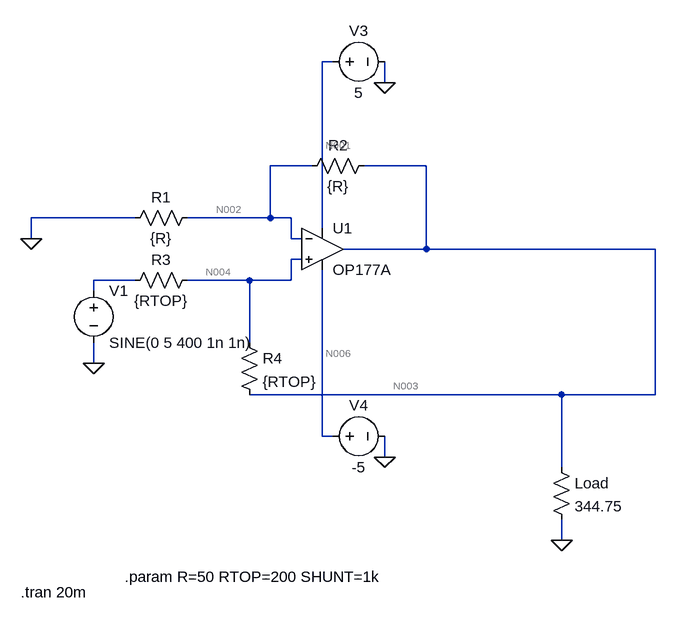
[diagram p0: schematic MHCP.asc]
MHCP.asc, the LTspice schematic file:
Version 4.1
SHEET 1 932 816
WIRE 432 -16 416 -16
WIRE 512 16 512 -16
WIRE 400 144 336 144
WIRE 576 144 480 144
WIRE 128 224 -32 224
WIRE 336 224 336 144
WIRE 336 224 208 224
WIRE 368 224 336 224
WIRE 416 240 416 -16
WIRE -32 256 -32 224
WIRE 368 256 368 224
WIRE 384 256 368 256
WIRE 576 272 576 144
WIRE 576 272 448 272
WIRE 928 272 576 272
WIRE 384 288 368 288
WIRE 128 320 64 320
WIRE 304 320 208 320
WIRE 368 320 368 288
WIRE 368 320 304 320
WIRE 64 336 64 320
WIRE 304 416 304 320
WIRE 64 448 64 416
WIRE 784 496 304 496
WIRE 928 496 928 272
WIRE 928 496 784 496
WIRE 416 560 416 304
WIRE 432 560 416 560
WIRE 512 592 512 560
WIRE 784 608 784 496
WIRE 784 720 784 688
FLAG 784 720 0
FLAG -32 256 0
FLAG 64 448 0
FLAG 512 16 0
FLAG 512 592 0
SYMBOL OpAmps\\OP177A 416 208 R0
SYMATTR InstName U1
SYMBOL res 224 208 R90
WINDOW 0 0 56 VBottom 2
WINDOW 3 32 56 VTop 2
SYMATTR InstName R1
SYMATTR Value {R}
SYMBOL res 496 128 R90
WINDOW 0 0 56 VBottom 2
WINDOW 3 32 56 VTop 2
SYMATTR InstName R2
SYMATTR Value {R}
SYMBOL res 224 304 R90
WINDOW 0 0 56 VBottom 2
WINDOW 3 32 56 VTop 2
SYMATTR InstName R3
SYMATTR Value {RTOP}
SYMBOL res 288 400 R0
SYMATTR InstName R4
SYMATTR Value {RTOP}
SYMBOL res 768 592 R0
SYMATTR InstName Load
SYMATTR Value 344.75
SYMBOL voltage 64 320 R0
WINDOW 123 0 0 Left 0
WINDOW 39 0 0 Left 0
SYMATTR InstName V1
SYMATTR Value SINE(0 5 400 1n 1n)
SYMBOL voltage 416 -16 R270
WINDOW 0 32 56 VTop 2
WINDOW 3 -32 56 VBottom 2
WINDOW 123 0 0 Left 0
WINDOW 39 0 0 Left 0
SYMATTR InstName V3
SYMATTR Value 5
SYMBOL voltage 416 560 R270
WINDOW 0 32 56 VTop 2
WINDOW 3 -32 56 VBottom 2
WINDOW 123 0 0 Left 0
WINDOW 39 0 0 Left 0
SYMATTR InstName V4
SYMATTR Value -5
TEXT 112 776 Left 2 !.param R=50 RTOP=200 SHUNT=1k
TEXT -48 800 Left 2 !.tran 20m

The netlist it stands for:
* MHCP.asc
X§U1 N004 N002 N001 N006 N003 OP177A  ; pins In+ In- V+ V- OUT
R1 N002 0 {R}
R2 N003 N002 {R}
R3 N004 N005 {RTOP}
R4 N004 N003 {RTOP}
R§Load N003 0 344.75
V1 N005 0 SINE(0 5 400 1n 1n)
V3 N001 0 5
V4 N006 0 -5
.param R=50 RTOP=200 SHUNT=1k
.tran 20m
.backanno
.end

* Results of the author's LTspice run, read from the files saved beside the schematic
* Operating Point, zero values left out:
*   V(n001) = 5 V
*   V(n002) = 672.3 mV
*   V(n003) = 1.345 V
*   V(n004) = 672.3 mV
*   V(n006) = -5 V
*   I(Load) = 3.9 mA
*   I(R1) = 13.45 mA
*   I(R2) = 13.45 mA
*   I(R3) = 3.362 mA
*   I(R4) = -3.362 mA
*   I(V1) = 3.362 mA
*   I(V3) = -21.86 mA
*   I(V4) = 21.86 mA
*   Ix(u1:1) = 1.253 nA
*   Ix(u1:2) = 953.5 pA
*   Ix(u1:3) = 21.86 mA
*   Ix(u1:4) = -21.86 mA
*   Ix(u1:5) = -20.71 mA
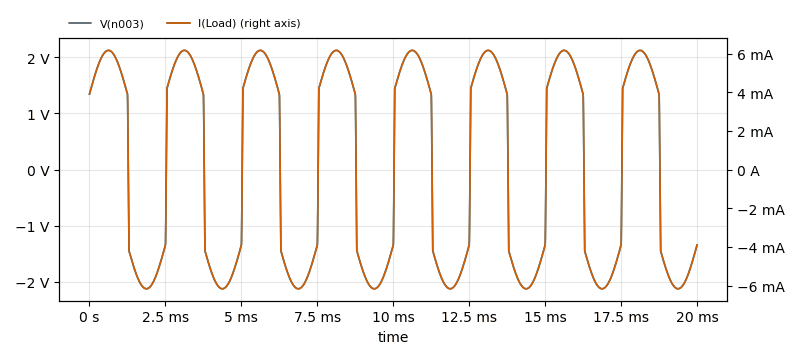
[diagram p1: Transient Analysis of MHCP.asc, plotted from the saved traces]
* Transient Analysis, 1 run:
*   V(n003): min -2.125 V, max 2.125 V, average 3.647 mV, rms 1.846 V, last -1.345 V
*   I(Load): min -6.164 mA, max 6.163 mA, average 10.58 µA, rms 5.354 mA, last -3.902 mA